# EAGLE design u_build_45w_ps (EAGLE 7.7.0)
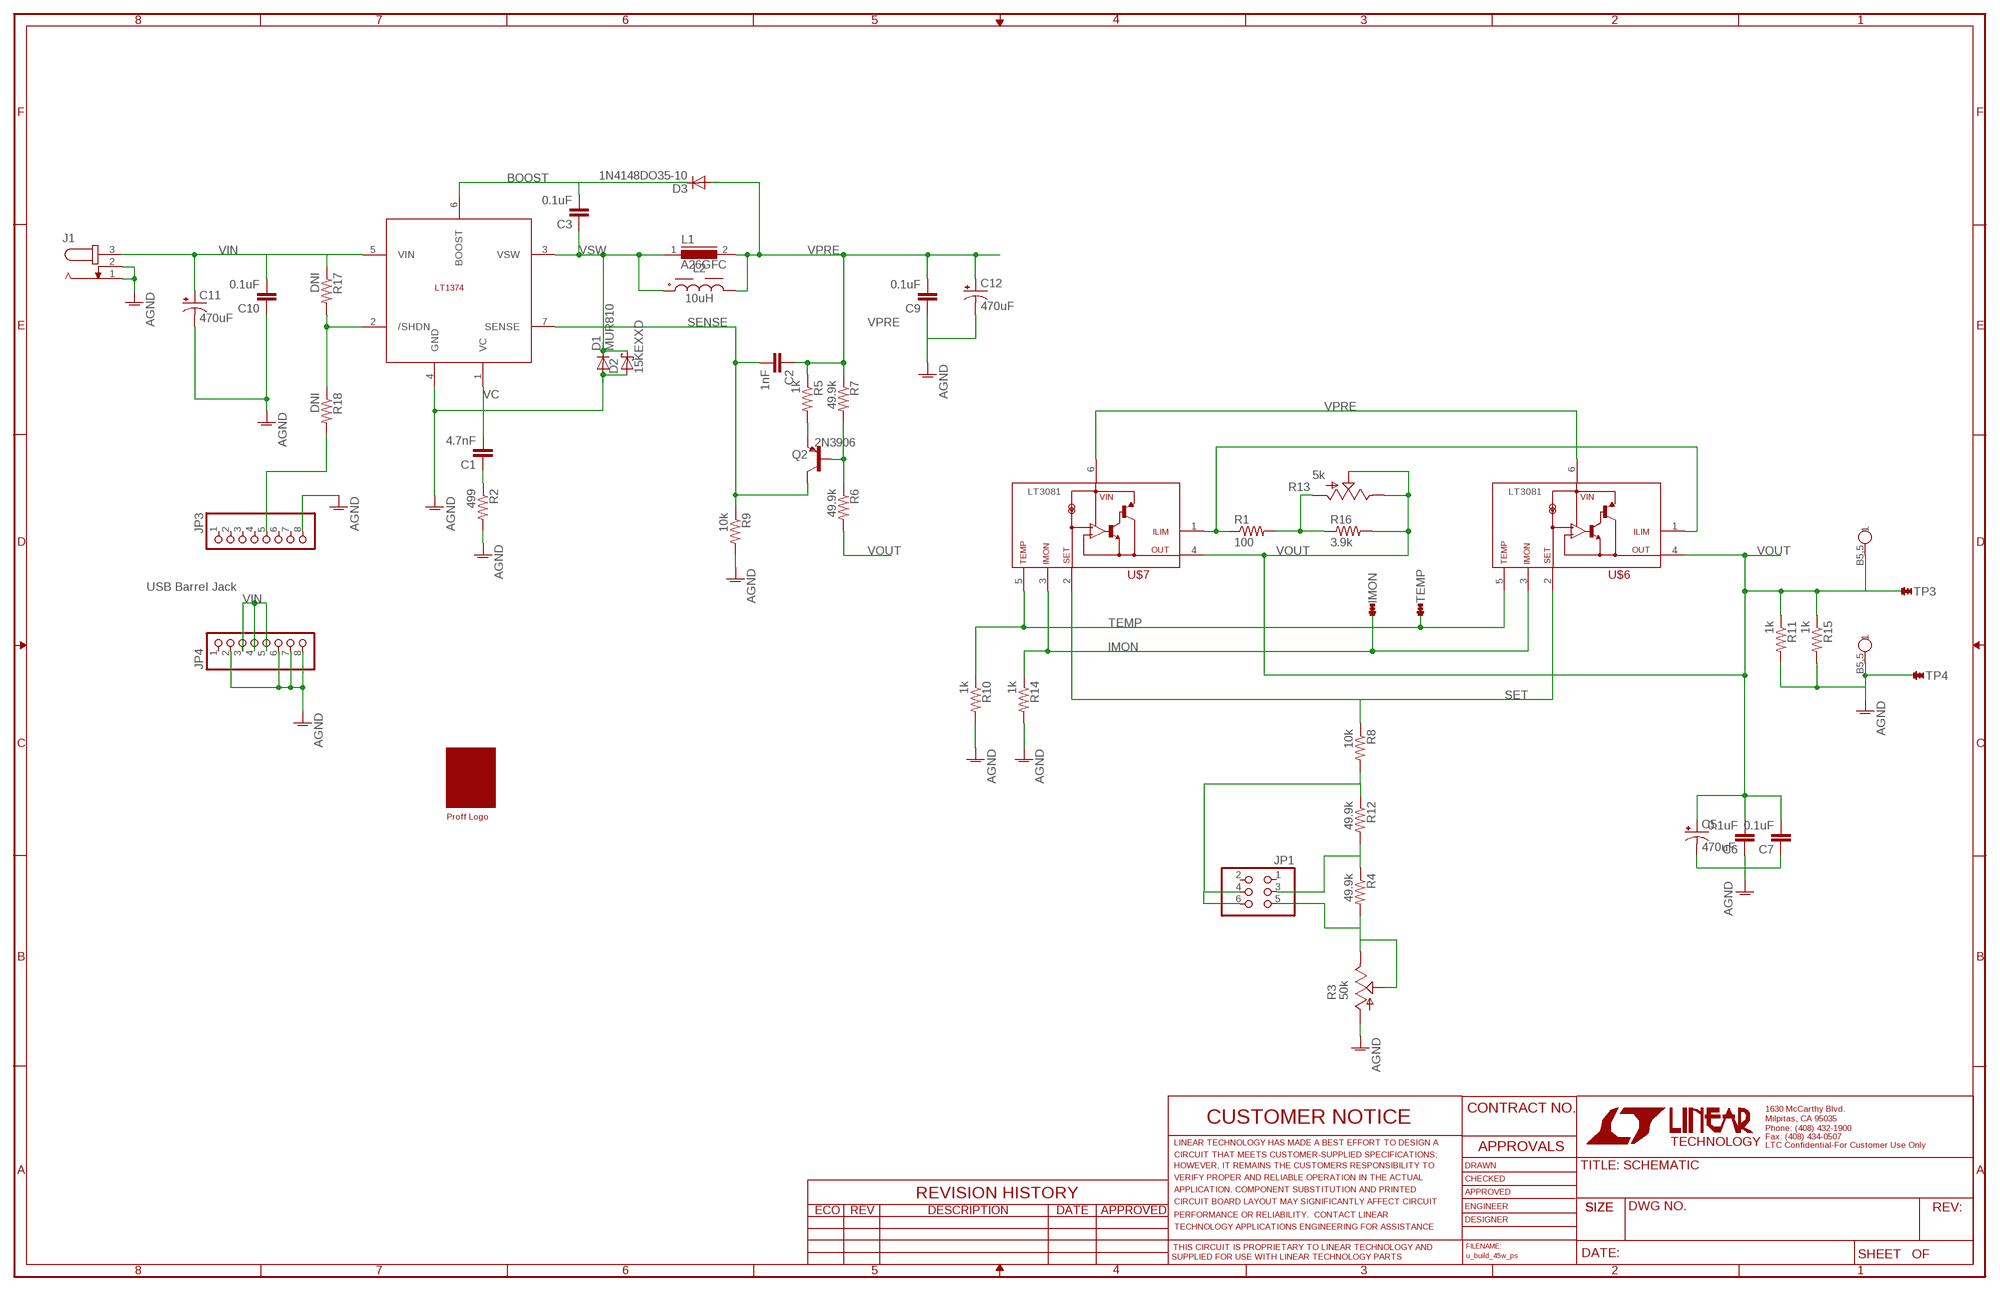
[diagram p0: schematic, sheet 1]

## Parts
C1  4.7nF  C-EU050-025X075  [C050-025X075]
C2  1nF  C-EU050-025X075  [C050-025X075]
C3  0.1uF  C-EU050-025X075  [C050-025X075]
C5  470uF  CPOL-USE5-10.5  [E5-10,5]
C6  0.1uF  C-EU050-045X075  [C050-045X075]
C7  0.1uF  C-EU050-045X075  [C050-045X075]
C9  0.1uF  C-EU050-045X075  [C050-045X075]
C10  0.1uF  C-EU050-045X075  [C050-045X075]
C11  470uF  CPOL-USE5-10.5  [E5-10,5]
C12  470uF  CPOL-USE5-10.5  [E5-10,5]
D1  MUR810  [TO220ACS]
D2  15KEXXD  [DO201T15]
D3  1N4148DO35-10  [DO35-10]
IC2  LT1374TO220-7  [LT3081]
IMON  TURRET0.092  [TURRET_MILLMAX_2501-2]
J1  JACK-PLUG0  [SPC4077]
J5  BAN_JACK1  [PC_BAN_JACK]
J6  BAN_JACK1  [PC_BAN_JACK]
JP1  PINHD-2X3  [2X03]
JP3  PINHD-1X8  [1X08]
JP4  PINHD-1X8  [1X08]
L1  A26GFC  [A26GFC]
L2  10uH  WE-TIS_1111_7447471100  [WE-TIS_1111]
Q2  2N3906  [TO92]
R1  100  R-US_0207/10  [0207/10]
R2  499  R-US_0207/10  [0207/10]
R3  50k  TRIM_US-RS3  [RS3]
R4  49.9k  R-US_0207/10  [0207/10]
R5  1k  R-US_0207/10  [0207/10]
R6  49.9k  R-US_0207/10  [0207/10]
R7  49.9k  R-US_0207/10  [0207/10]
R8  10k  R-US_0207/10  [0207/10]
R9  10k  R-US_0207/10  [0207/10]
R10  1k  R-US_0207/10  [0207/10]
R11  1k  R-US_0207/10  [0207/10]
R12  49.9k  R-US_0207/10  [0207/10]
R13  5k  TRIM_US-RS3  [RS3]
R14  1k  R-US_0207/10  [0207/10]
R15  1k  R-US_0207/10  [0207/10]
R16  3.9k  R-US_0207/10  [0207/10]
R17  DNI  R-US_0207/10  [0207/10]
R18  DNI  R-US_0207/10  [0207/10]
TEMP  TURRET0.092  [TURRET_MILLMAX_2501-2]
TP3  TURRET0.092  [TURRET_MILLMAX_2501-2]
TP4  TURRET0.092  [TURRET_MILLMAX_2501-2]
U$1  PROFF  [PROFF]
U$6  LT3081  [LT3081]
U$7  LT3081  [LT3081]

## Nets
AGND: C5.- C6.1 C7.1 C9.1 C10.1 C11.- C12.- D1.A D2.A IC2.4(GND) J1.1 J1.2 J6.B5,5 JP3.8 JP4.2 JP4.6 JP4.7 JP4.8 R2.2 R3.A R9.2 R10.2 R11.2 R14.2 R15.2 TP4.1
BOOST: C3.2 D3.C IC2.6(BOOST)
ILIM: R1.1 U$6.1(ILIM) U$7.1(ILIM)
IMON: IMON.1 R14.1 U$6.3(IMON) U$7.3(IMON)
N$1: C1.1 R2.1
N$2: IC2.2(/SHDN) R17.2 R18.1
N$3: JP1.5 R3.E R3.S R4.2
N$4: JP1.3 R4.1 R12.2
N$5: R1.2 R13.A R16.1
N$6: JP3.5 R18.2
N$8: JP1.4 JP1.6 R8.2 R12.1
N$13: Q2.2(B) R6.1 R7.2
N$33: Q2.3(E) R5.2
SENSE: C2.2 IC2.7(SENSE) Q2.1(C) R9.1
SET: R8.1 U$6.2(SET) U$7.2(SET)
TEMP: R10.1 TEMP.1 U$6.5(TEMP) U$7.5(TEMP)
VC: C1.2 IC2.1(VC)
VIN: C10.2 C11.+ IC2.5(VIN) J1.3 JP4.3 JP4.4 JP4.5 R17.1
VOUT: C5.+ C6.2 C7.2 J5.B5,5 R6.2 R11.1 R13.E R13.S R15.1 R16.2 TP3.1 U$6.4(OUT) U$7.4(OUT)
VPRE: C2.1 C9.2 C12.+ D3.A L1.2 L2.2 R5.1 R7.1 U$6.6(VIN) U$7.6(VIN)
VSW: C3.1 D1.C D2.C IC2.3(VSW) L1.1 L2.1
Unconnected: JP1.1 JP1.2 JP3.1 JP3.2 JP3.3 JP3.4 JP3.6 JP3.7 JP4.1

## Notes on the sheet
- USB Barrel Jack

## Library data of the parts
C1-C3 C6 C7 C9 C10 = rcl:C-EU: CAPACITOR, European symbol
C5 C11 C12 = rcl:CPOL-US: POLARIZED CAPACITOR, American symbol
D1 = diode:MUR810: DIODE
D2 = diode:15KEXXD: DIODE
D3 = diode:1N4148: DIODE high speed (Philips)
IC2 = Econo_LT3081_rev3:LT1374
IMON TEMP TP3 TP4 = LTDB_Connectors:TURRET: Turret
J1 = con-jack:JACK-PLUG: DC POWER JACK Power Jack, DC, Right Angle, Through Hole, Rated 5A at 16VDC, PC Terminals Distributor: Farnell (www.Farnell.de) Drawing: 84N1161.pdf / 84N1162.pdf Manufacturer: SPC Technology (www.spctechnology.com) Type: SPC4077 / SPC 4078; OC_FARNELL: unknown; OC_NEWARK: unknown
J5 J6 = AAA_MARKS_CUSTOM:BAN_JACK
JP1 = pinhead:PINHD-2X3: PIN HEADER
JP3 JP4 = pinhead:PINHD-1X8: PIN HEADER
L1 = inductors:A26GFC: INDUCTOR
L2 = Eagle_WE-TIS (rev22a):WE-TIS_1111: WE-TIS Radial Leaded Wire Wound Inductor Shielded Characteristics Radial through-hole inductor High saturation core material High current capacity Custom design on request Applications Signal filtering Switches, switching power supply for small and medium voltage Power supply filter EMI filter <https://www.we-online.com/catalog/media/o14867v209%20Family_WE-TIS.jpg> Details see: www.we-online.com/catalog/WE-TIS <www.we-online.com/catalog/WE-TIS/?utm_source=eagle_model&utm_medium=description_link&utm_campaign=eisos_eagle> Updated by Ella Wu, 2022-06-16 2022 (C) Wurth Elektronik; DATASHEET-URL: https://www.we-online.com/redexpert/spec/7447471100?ae; FRES: 46MHz; IR: 5A; ISAT: 6.6A; MOUNT: THT; PART-NUMBER: 7447471100; RDC-MAX: 26mohm; RDC-TYP: 24mohm
Q2 = transistor-pnp:2N3906: PNP Transistor
R1 R2 R4-R12 R14-R18 = rcl:R-US_: RESISTOR, American symbol
R3 R13 = pot:TRIM_US-: POTENTIOMETER
U$1 = logo:PROFF
U$6 U$7 = sallib:LT3081

## Net classes
0 default: width 0.254 mm, drill 0.305 mm, clearance 0.152 mm
1 power: width 0.61 mm, drill 0.508 mm, clearance 0.152 mm
2 gnd: width 0.305 mm, drill 0.508 mm, clearance 0.152 mm
3 usbvcc: width 0.508 mm, drill 0.508 mm, clearance 0.152 mm
4 aref: width 0.406 mm

## Board
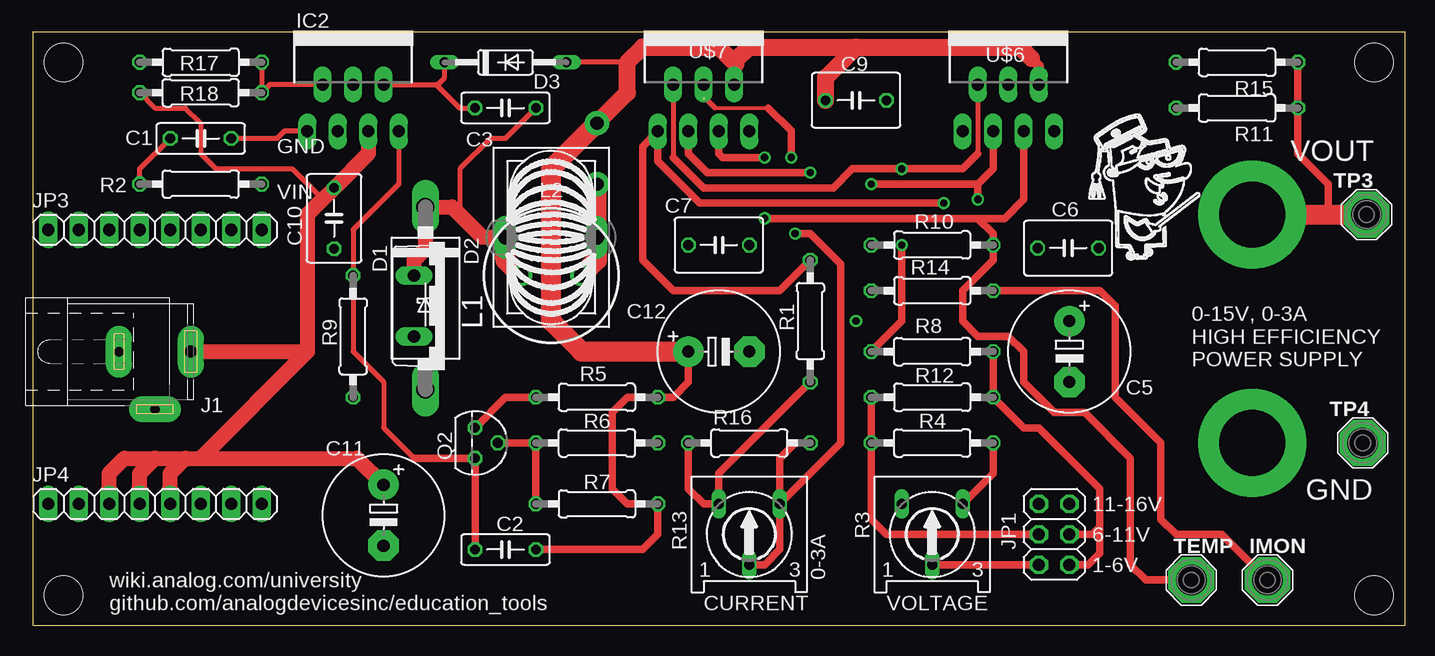
[diagram p1: board, top side]
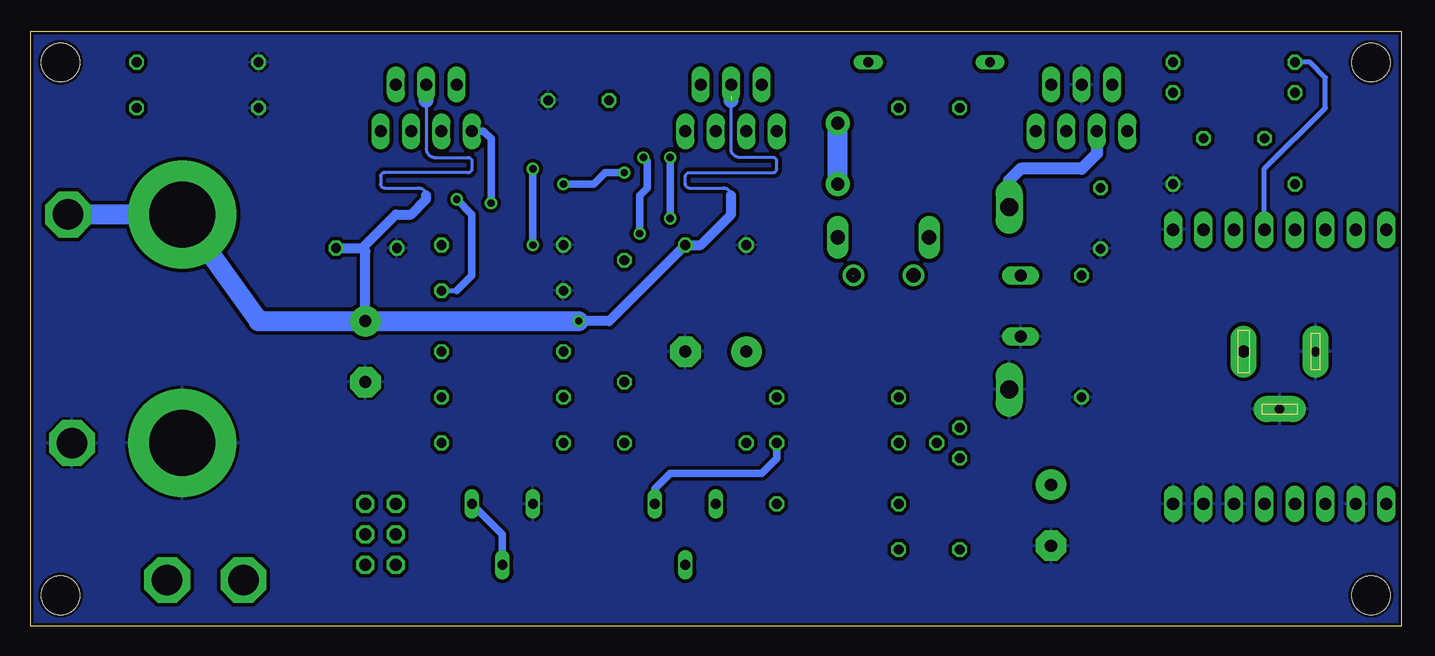
[diagram p2: board, bottom side, seen from below]

Size 114.3 x 49.53 mm. Coordinates in mm from the lower left corner, seen from the top.
Outline: 0,0 0,49.53 114.3,49.53 114.3,0 0,0
Copper layers (1*16): Top 2mil / dielectric 17mil / Bottom 2mil
Design rules "Kim-Design Rules *": minimum track width 10mil, minimum drill 12mil, track to track 12mil, track to pad 12mil, pad to pad 12mil, via to via 12mil, smd to smd 0mil, copper to edge 10mil, drill to drill 10mil, minimum pad ring 8mil, minimum via ring 8mil, stop-mask expansion 4mil, vias tented up to drill 15mil, thermal gap 10mil
Holes 3.2 mm at 2.54,46.99 2.54,2.54 111.76,46.99 111.76,2.54

### Footprints (pad centres in the part's own frame; a part is rotated, then mirrored left to right if it is on the bottom)
C050-025X075 = drill 0.813 octagon: 1 -2.54,0; 2 2.54,0
E5-10,5 = drill 1.016 pad 2.54: + -2.54,0 | drill 1.016 pad 2.54 octagon: - 2.54,0
C050-045X075 = drill 0.813 octagon: 1 -2.54,0; 2 2.54,0
TO220ACS = drill 1.016 long: A 2.54,-2.54; C -2.54,-2.54
DO201T15 = drill 1.499 long: A 7.62,0; C -7.62,0
DO35-10 = drill 0.813 long: A 5.08,0; C -5.08,0
LT3081 = drill 1 pad 1.2 long: 1 -3.81,-5.75; 2 -2.54,-1.85; 3 -1.27,-5.75; 4 0,-1.85; 5 1.27,-5.75; 6 2.54,-1.85; 7 3.81,-5.75
TURRET_MILLMAX_2501-2 = drill 2.54 pad 3.81 octagon: 1 0,0
SPC4077 = drill 0.8 pad 2.184 long: 1 -3,0; 2 0,-4.8 | drill 1 pad 2.184 long: 3 3,0
PC_BAN_JACK = drill 5.5 pad 9: B5,5 0,0
2X03 = drill 1.016 octagon: 1 -2.54,-1.27; 2 -2.54,1.27; 3 0,-1.27; 4 0,1.27; 5 2.54,-1.27; 6 2.54,1.27
1X08 = drill 1.016 long: 1 -8.89,0; 2 -6.35,0; 3 -3.81,0; 4 -1.27,0; 5 1.27,0; 6 3.81,0; 7 6.35,0; 8 8.89,0
A26GFC = drill 1.194 long: 1 0,3.81; 2 0,-3.81
WE-TIS_1111 = drill 1.2: 1 -2.5,0; 2 2.5,0
TO92 = drill 0.813 octagon: 1 1.27,0; 2 0,1.905; 3 -1.27,0
0207/10 = drill 0.813 octagon: 1 -5.08,0; 2 5.08,0
RS3 = drill 0.813 long: A -2.54,2.54; E 2.54,2.54; S 0,-2.54

### Placement (x,y rotation side)
C1  13.97,40.64 0 top
C2  39.37,6.35 180 top
C3  39.37,43.18 180 top
C5  86.36,22.86 270 top
C6  86.26,31.5 0 top
C7  57.15,31.75 0 top
C9  68.58,43.81 180 top
C10  25.08,33.97 90 top
C11  29.21,9.21 270 top
C12  57.15,22.86 0 top
D1  34.29,26.67 270 top
D2  32.7,27.3 270 top
D3  39.37,46.99 0 top
IC2  26.67,46.99 0 top
IMON  102.87,3.81 0 top
J1  10.16,22.86 0 top
J5  101.6,34.29 0 top
J6  101.6,15.24 0 top
JP1  85.09,7.62 270 top
JP3  10.16,33.02 0 top
JP4  10.16,10.16 0 top
L1  43.18,32.38 90 top
L2  43.18,29.21 0 top
Q2  36.83,15.24 270 top
R1  64.77,25.4 270 top
R2  13.97,36.83 0 top
R3  74.93,7.62 0 top
R4  74.93,15.24 0 top
R5  46.99,19.05 180 top
R6  46.99,15.24 0 top
R7  46.99,10.16 180 top
R8  74.93,22.86 0 top
R9  26.67,24.13 270 top
R10  74.93,31.75 180 top
R11  100.33,43.18 180 top
R12  74.93,19.05 180 top
R13  59.69,7.62 0 top
R14  74.93,27.94 180 top
R15  100.33,46.99 180 top
R16  59.69,15.24 0 top
R17  13.97,44.45 0 top
R18  13.97,46.99 180 top
TEMP  96.52,3.81 0 top
TP3  111.12,34.29 0 top
TP4  110.81,15.24 0 top
U$1  87.95,30.48 0 top
U$6  81.28,46.99 0 top
U$7  55.88,46.99 0 top

### Tracks (layer width: path | path; a pad name or v marks a point on that pad's centre or on a via)
AGND
  pour Bottom: -2.54,-5.08 118.11,-5.08 118.11,52.07 -2.54,52.07
BOOST
  Top 0.406: IC2.6 33.6,45.14 | 33.6,45.14 35.56,43.18 C3.2 | 33.6,45.14 33.71,45.14 34.29,45.72 D3.C
ILIM  (via drill 0.6)
  Top 0.61: v75.88,35.24 55.56,35.24 52.07,38.73 U$7.1 50.8,39.97 50.8,30.48 53.34,27.94 62.23,27.94 R1.1
  Bottom 0.61: v75.88,35.24 75.88,40.6 76.52,41.24 U$6.1
IMON  (via drill 0.6)
  Top 0.61: U$7.3 54.61,39.37 56.2,37.78 v64.77,37.78 | U$6.3 80.01,38.1 78.74,36.83 | 78.74,36.83 v69.85,36.83 | v78.74,35.56 78.74,36.83 | IMON.1 99.06,7.62 95.25,7.62 93.98,8.89 93.98,15.24 90.17,19.05 90.17,26.67 88.9,27.94 R14.1
  Bottom 0.406: R14.1 78.74,27.94
  Bottom 0.61: 78.74,27.94 77.47,29.21 77.47,34.29 v78.74,35.56 | v64.77,37.78 66.36,37.78 67.31,36.83 v69.85,36.83
N$1
  Top 0.406: R2.1 8.89,38.1 C1.1
N$2
  Top 0.406: IC2.2 19.74,45.14 R17.2 R18.1
N$3
  Top 0.61: R4.2 80.01,12.7 R3.E | JP1.5 R3.S
  Bottom 0.61: R3.S 74.93,7.62 R3.E
N$4
  Top 0.61: R12.2 R4.1 69.85,8.89 71.12,7.62 JP1.3
N$5
  Top 0.61: R1.2 57.15,12.7 R13.A 55.88,10.16 54.61,11.43 R16.1
N$6
  Bottom 0.406: JP3.5 11.43,38.1 6.35,43.18 6.35,45.72 7.62,46.99 R18.2
N$8
  Top 0.61: R8.2 R12.1 82.55,16.51 83.82,16.51 88.9,11.43 88.9,8.26 | 88.9,8.26 88.27,7.62 JP1.4 | JP1.6 87.95,5.08 88.9,6.03 88.9,8.26
N$13
  Top 0.61: R7.2 R6.1 40.64,15.24 Q2.2
N$33
  Top 0.61: R5.2 39.37,19.05 Q2.3
SENSE
  Top 0.406: IC2.7 30.48,36.83 26.67,33.02 R9.1 26.67,22.86 29.21,20.32 29.21,16.51 31.75,13.97
  Top 0.61: C2.2 Q2.1 31.75,13.97
SET  (via drill 0.6)
  Top 0.406: U$7.2 53.34,39.05 | U$6.2 78.74,39.37
  Top 0.61: 53.34,39.05 55.88,36.51 66.67,36.51 68.26,38.1 v72.39,38.1 77.47,38.1 78.74,39.37 | R8.1 72.39,25.4 v72.39,31.75
  Bottom 0.61: v72.39,31.75 v72.39,38.1
TEMP  (via drill 0.6)
  Top 0.61: U$7.5 57.15,39.37 57.47,39.05 v60.96,39.05 | 78.74,33.97 80.96,33.97 82.55,35.56 U$6.5 | 78.74,33.97 v60.96,33.97 | 78.74,33.97 80.01,32.7 R10.1 80.01,30.48 77.47,27.94 77.47,25.4 78.74,24.13 81.28,24.13 82.55,22.86 82.55,20.32 85.09,17.78 87.63,17.78 91.44,13.97 91.44,5.08 92.71,3.81 TEMP.1
  Bottom 0.61: v60.96,39.05 v60.96,33.97
VC
  Top 0.406: IC2.1 20.92,41.24 20.32,40.64 C1.2
VIN
  Top 0.406: R17.1 10.16,43.18 12.7,43.18 13.97,41.91 13.97,39.37 15.24,38.1 21.59,38.1 24.13,35.56
  Top 1.27: IC2.5 27.94,39.37 C10.2 24.13,35.56 22.86,34.29 22.86,22.86 | JP4.3 6.35,12.7 7.62,13.97 10.16,13.97 | 10.16,13.97 12.7,13.97 | 12.7,13.97 13.97,13.97 | 13.97,13.97 26.99,13.97 C11.+ | JP4.4 8.89,12.7 10.16,13.97 | JP4.5 11.43,12.7 12.7,13.97 | 22.86,22.86 13.97,13.97 | J1.3 22.86,22.86
VOUT  (via drill 0.6)  (1 unrouted)
  Top 0.305: 61.28,43.18 56.83,43.18
  Top 0.406: 56.83,43.18 55.88,44.13
  Top 0.61: R13.E 62.23,6.35 60.96,5.08 R13.S | R13.E 67.31,15.24 67.31,30.16 64.77,32.7 v63.5,32.7 | R15.1 R11.1 105.41,39.37 107.95,36.83 107.95,34.29 | R16.2 63.5,15.24 62.23,13.97 R13.E | v63.18,39.05 63.18,41.27 61.28,43.18
  Top 1.676: J5.B5,5 107.95,34.29 111.76,34.29
  Bottom 0.254: 55.88,43.81 55.88,39.76 arc-90 55.17,39.05 52.39,39.05 arc90 52.07,38.73 52.07,38.1 arc90 52.39,37.78 59.37,37.78 arc-90 59.69,37.47 59.69,36.83 arc-90 59.37,36.51 56.52,36.51 arc90 55.88,35.88 | 81.28,43.81 81.28,39.76 arc-90 80.57,39.05 77.79,39.05 arc90 77.47,38.73 77.47,38.1 arc90 77.79,37.78 84.77,37.78 arc-90 85.09,37.47 85.09,36.83 arc-90 84.77,36.51 81.92,36.51 arc90 81.28,35.88
  Bottom 0.406: U$7.4 55.88,45.09 | 81.28,45.09 U$6.4
  Bottom 0.61: R6.2 52.07,13.97 53.34,12.7 60.96,12.7 62.23,11.43 R13.E | v63.5,32.7 63.5,35.88 62.86,36.51 62.86,38.73 v63.18,39.05
  Bottom 0.813: 55.88,35.88 55.88,34.29 58.42,31.75 C7.2 66.04,25.4 v68.58,25.4 | C6.2 86.61,31.5 | 86.61,31.5 83.82,34.29 82.55,34.29 81.28,35.56 81.28,35.88 | C5.+ 86.36,31.24 86.61,31.5
  Bottom 1.27: 81.28,43.81 81.28,45.09 | 55.88,43.81 55.88,45.09
  Bottom 1.676: v68.58,25.4 C5.+ 95.25,25.4 J5.B5,5 TP3.1
VPRE  (via drill 1.1 pad 2.03)  (1 unrouted)
  Top 0.406: 49.53,46.99 D3.A
  Top 0.61: C2.1 50.8,6.35 52.07,7.62 R7.1 49.53,10.16 48.26,11.43 48.26,17.78 49.53,19.05 R5.1 53.34,19.05 54.61,20.32 C12.+
  Top 0.813: U$6.6 83.82,46.67 83.19,47.31 | 58.58,46.83 58.42,46.67 U$7.6
  Top 1.422: v46.99,41.91 49.53,44.45 49.53,46.99 50.8,48.26 57.15,48.26 58.58,46.83 58.58,47.15 59.69,48.26 68.58,48.26 | 68.58,48.26 82.55,48.26 82.55,47.94 83.19,47.31 | C9.2 66.04,45.72 68.58,48.26
  Top 1.676: v46.99,36.83 L1.2 46.99,30.48 45.72,29.21 | v46.99,41.91 43.18,38.1 43.18,25.4 45.72,22.86 C12.+
  Bottom 1.676: v46.99,36.83 v46.99,41.91
VSW
  Top 0.406: C3.1 39.37,40.64 38.1,40.64 35.56,38.1 35.56,34.29
  Top 1.27: L1.1 37.47,32.38 35.56,34.29 34.92,34.92 D2.C 32.7,31.43 31.75,30.48 D1.C
  Top 1.676: L2.1 40.64,29.21 39.37,30.48 L1.1
  Bottom 1.016: IC2.3 25.4,39.37 26.67,38.1 31.75,38.1 32.7,37.15 D2.C

### Text on the board
tNames: GND | VOUT | VIN | 0-15V, 0-3A / HIGH EFFICIENCY / POWER SUPPLY | 11-16V | GND | 6-11V | 0-3A | 1-6V | wiki.analog.com/university | github.com/analogdevicesinc/education_tools | CURRENT | VOLTAGE